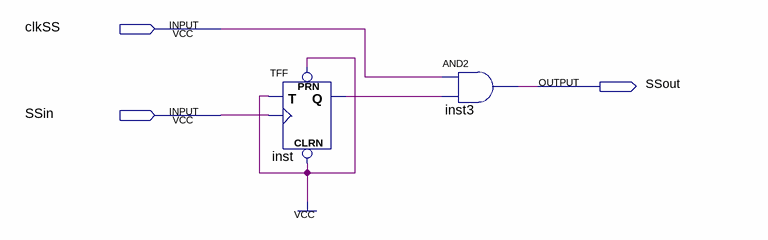
[diagram p0: schematic sheet]
// Quartus schematic SandS.bdf as structural Verilog: 2 symbols, 3 pins
module SandS (
  input  clkSS,
  input  SSin,
  output SSout
);

  wire inst_q;

  TFF inst (.PRN(1'b1), .CLRN(1'b1), .T(1'b1), .CLK(SSin), .Q(inst_q));
  and inst3 (SSout, clkSS, inst_q);
endmodule
